# Altium schematic sheet DSO_Clock.SchDoc: Schematic_Name
size A4; CompanyName: University of Melbourne; Engineer: Your Name Here; DocumentNumber: 1; Revision: 0.1; SheetNumber: 1; SheetTotal: 1; Title_Project: Project_Title; StudentNo: Student No.
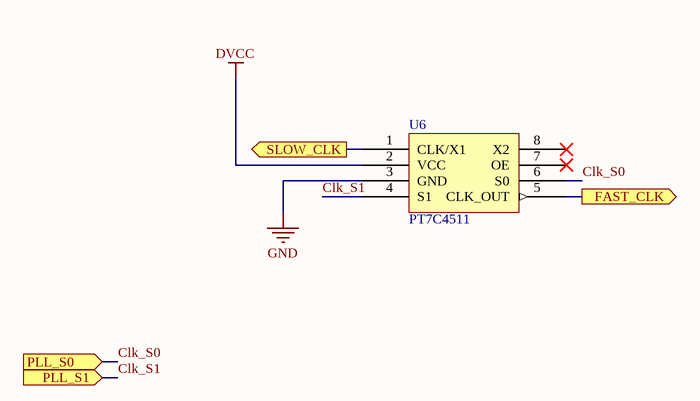
[diagram p0: DSO_Clock.SchDoc]

## Parts
U6  PT7C4511  [SOIC-8]

## Ports
FAST_CLK (out), PLL_S0 (in), PLL_S1 (in), SLOW_CLK (out)

## Nets
DVCC: U6.2(VCC)
GND: U6.3(GND)
Clk_S0: U6.6(S0) ; port PLL_S0
Clk_S1: U6.4(S1) ; port PLL_S1
FAST_CLK: U6.5(CLK_OUT) ; port FAST_CLK
SLOW_CLK: U6.1(CLK/X1) ; port SLOW_CLK

Not connected (* = marked no-connect by the designer): U6 7(OE)* 8(X2)*

## Library data of the parts
U6 = PT7C4511: PLL Clock Multiplier; Reviewed by: RM - 2018/08/05; Supplier 1: Digi-Key; Supplier Part Number 1: PT7C4511WEXDICT-ND